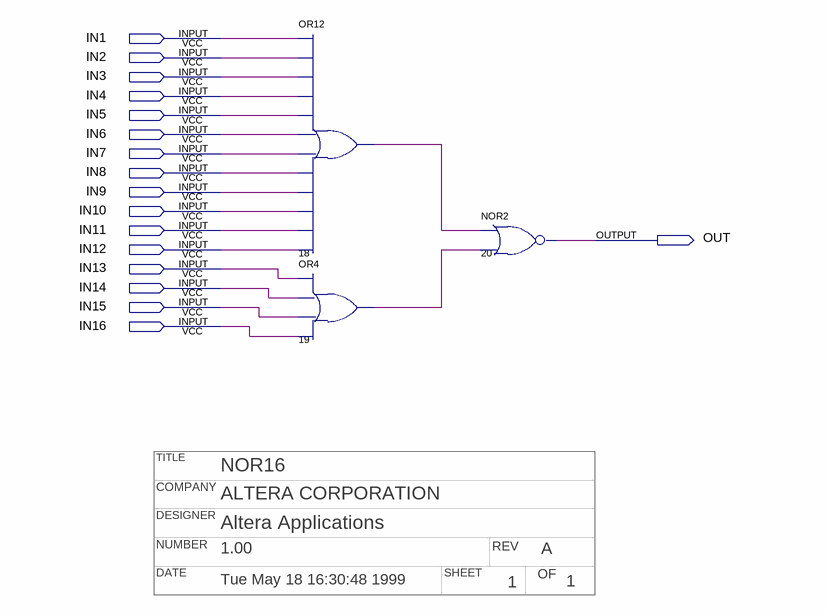
[diagram p0: schematic sheet]
// Quartus schematic nor16.bdf as structural Verilog: 3 symbols, 17 pins
// Title block: TITLE: NOR16; COMPANY: ALTERA CORPORATION; DESIGNER: Altera Applications; NUMBER: 1.00; REV: A; DATE: Tue May 18 16:30:48 1999; SHEET: 1; OF: 1
module nor16 (
  input  IN1,
  input  IN2,
  input  IN3,
  input  IN4,
  input  IN5,
  input  IN6,
  input  IN7,
  input  IN8,
  input  IN9,
  input  IN10,
  input  IN11,
  input  IN12,
  input  IN13,
  input  IN14,
  input  IN15,
  input  IN16,
  output OUT
);

  wire n18_out, n19_out;

  or u_18 (n18_out, IN1, IN2, IN3, IN4, IN5, IN6, IN7, IN8, IN9, IN10, IN11, IN12);
  or u_19 (n19_out, IN13, IN14, IN15, IN16);
  nor u_20 (OUT, n18_out, n19_out);
endmodule
